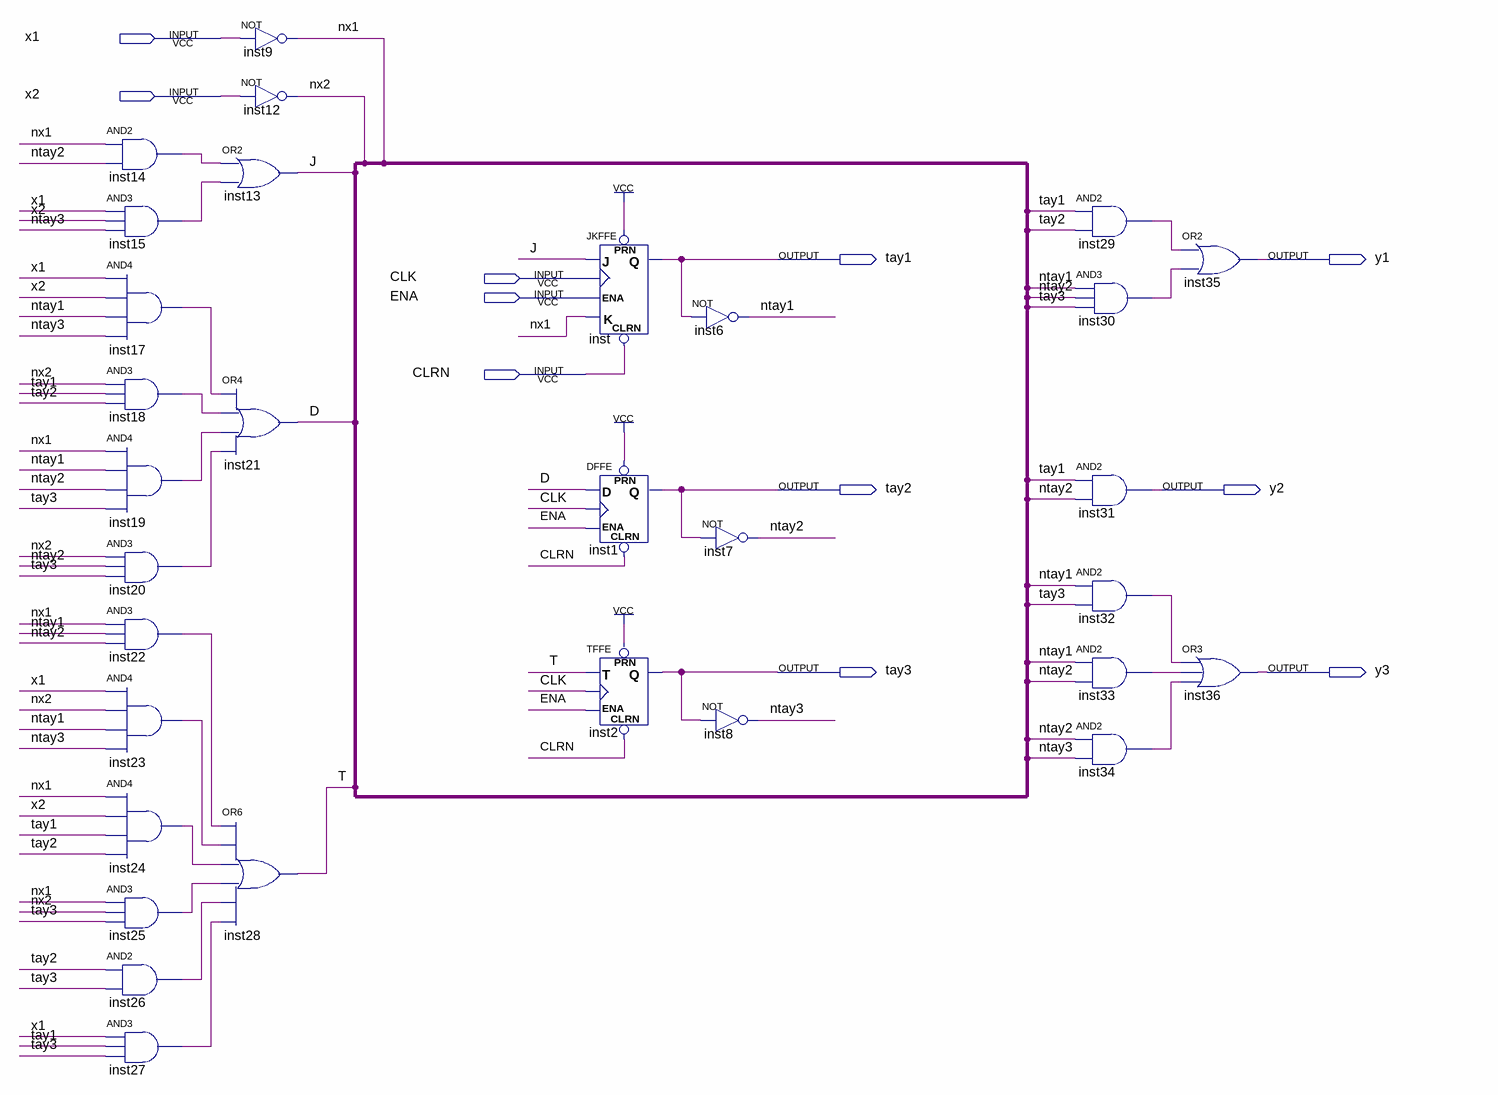
[diagram p0: schematic sheet]
// Quartus schematic avtomat_myra.bdf as structural Verilog: 31 symbols, 11 pins
module avtomat_myra (
  input  x1,
  input  x2,
  input  CLK,
  input  ENA,
  input  CLRN,
  output tay1,
  output y1,
  output tay2,
  output y2,
  output tay3,
  output y3
);

  wire D, inst14_out, inst15_out, inst17_out, inst18_out, inst19_out, inst20_out, inst22_out, inst23_out,
       inst24_out, inst25_out, inst26_out, inst27_out, inst29_out, inst30_out, inst32_out, inst33_out,
       inst34_out, J, ntay1, ntay2, ntay3, nx1, nx2, T;

  and inst14 (inst14_out, nx1, ntay2);
  and inst15 (inst15_out, x1, x2, ntay3);
  and inst17 (inst17_out, x1, x2, ntay1, ntay3);
  and inst18 (inst18_out, nx2, tay1, tay2);
  and inst19 (inst19_out, nx1, ntay1, ntay2, tay3);
  and inst20 (inst20_out, nx2, ntay2, tay3);
  and inst22 (inst22_out, nx1, ntay1, ntay2);
  and inst23 (inst23_out, x1, nx2, ntay1, ntay3);
  and inst24 (inst24_out, nx1, x2, tay1, tay2);
  and inst25 (inst25_out, nx1, nx2, tay3);
  and inst26 (inst26_out, tay2, tay3);
  and inst27 (inst27_out, x1, tay1, tay3);
  not inst9 (nx1, x1);
  not inst12 (nx2, x2);
  or inst13 (J, inst14_out, inst15_out);
  or inst21 (D, inst17_out, inst18_out, inst19_out, inst20_out);
  or inst28 (T, inst22_out, inst23_out, inst24_out, inst25_out, inst26_out, inst27_out);
  JKFFE inst (.PRN(1'b1), .J(J), .CLK(CLK), .CLRN(CLRN), .K(nx1), .ENA(ENA), .Q(tay1));
  DFFE inst1 (.PRN(1'b1), .CLRN(CLRN), .D(D), .CLK(CLK), .ENA(ENA), .Q(tay2));
  TFFE inst2 (.CLRN(CLRN), .T(T), .CLK(CLK), .ENA(ENA), .PRN(1'b1), .Q(tay3));
  not inst6 (ntay1, tay1);
  not inst7 (ntay2, tay2);
  not inst8 (ntay3, tay3);
  and inst29 (inst29_out, tay1, tay2);
  and inst30 (inst30_out, ntay1, ntay2, tay3);
  and inst31 (y2, tay1, ntay2);
  and inst32 (inst32_out, ntay1, tay3);
  and inst33 (inst33_out, ntay1, ntay2);
  and inst34 (inst34_out, ntay2, ntay3);
  or inst35 (y1, inst29_out, inst30_out);
  or inst36 (y3, inst32_out, inst33_out, inst34_out);
endmodule
